# Altium schematic sheet Sheet1.SchDoc
size A4
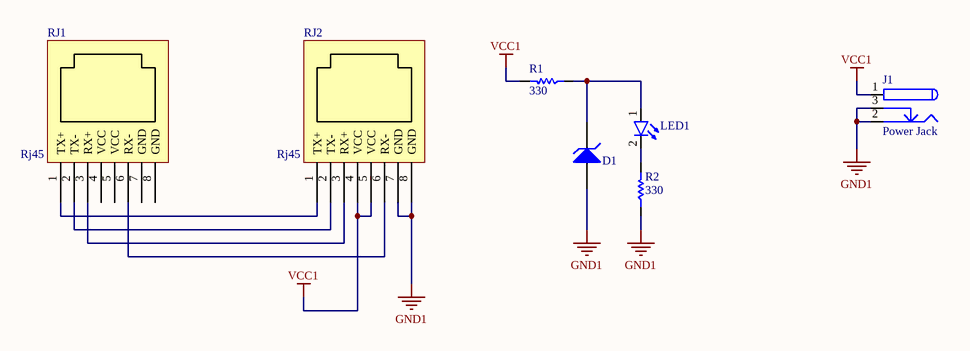
[diagram p0: Sheet1.SchDoc]

## Parts
D1  Diode Zener  [Diode 1W]  (value not drawn)
J1  Power Jack  [Power Jack]
LED1  Red  [LED-5mm]  (value not drawn)
R1  330  [RES 1206 (3216X08L)]
R2  330  [RES 1206 (3216X08L)]
RJ1  Rj45  [rj45-w57-1]
RJ2  Rj45  [rj45-w57-1]

## Nets
GND1: D1.1(A) J1.2 J1.3 R2.1 RJ2.7(GND) RJ2.8(GND)
VCC1: J1.1 R1.2 RJ2.4(VCC) RJ2.5(VCC)
NetD1_2: D1.2(K) LED1.1(A) R1.1
NetLED1_2: LED1.2(K) R2.2
NetRJ1_1: RJ1.1(TX+) RJ2.1(TX+)
NetRJ1_2: RJ1.2(TX-) RJ2.2(TX-)
NetRJ1_3: RJ1.3(RX+) RJ2.3(RX+)
NetRJ1_6: RJ1.6(RX-) RJ2.6(RX-)

Not connected (* = marked no-connect by the designer): RJ1 4(VCC) 5(VCC) 7(GND) 8(GND)

## Library data of the parts
D1 = Diode Zener: Zener Diode; Designer: Saeid Jorablo; Company: E.P.I.L; Voltage: 3.3 V; Design Date: 2011/11/02
J1 = Power Jack: Designer: Saeid Jorablo; Company: Personal; Project Name: Laser; Adding Date: 10/21/2009
LED1 = LED: Designer: Saeid Jorablo; Organazation: ControTec; Adding Date: 1387/12/22; Color: Red; Size: SMD 1206
R1 R2 = Resistor: Tolerance: 5%; Power: 1/8 W; Value: 330